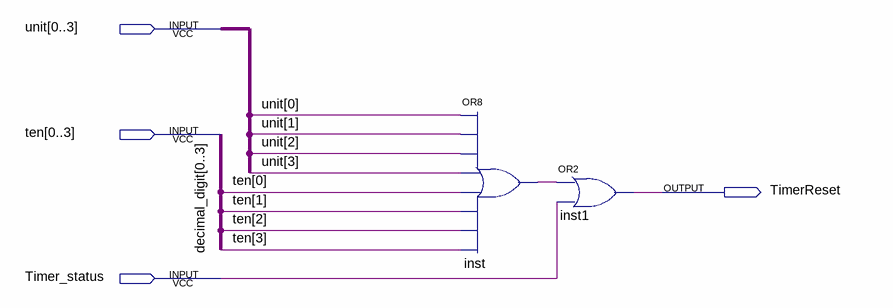
[diagram p0: schematic sheet]
// Quartus schematic SchematicStatus.bdf as structural Verilog: 2 symbols, 4 pins
module SchematicStatus (
  input  [0:3] unit,
  input  [0:3] ten,
  input  Timer_status,
  output TimerReset
);

  wire inst_out;

  or inst (inst_out, unit[0], unit[1], unit[2], unit[3], ten[0], ten[1], ten[2], ten[3]);
  or inst1 (TimerReset, inst_out, Timer_status);

  // Other names for the same wires on the sheet: decimal_digit[3:0] = {ten[3], ten[2], ten[1], ten[0]}
endmodule
